# EasyEDA Pro project GIM4310-10_4305-10.epro, board PCB1
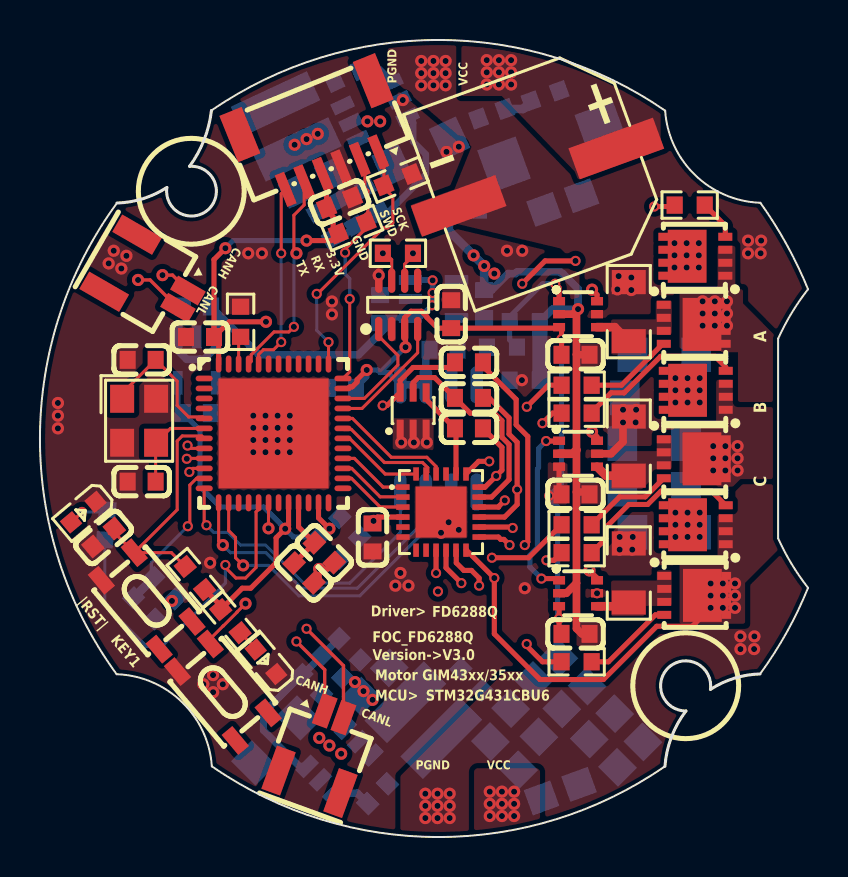
[diagram p1: board, top side]
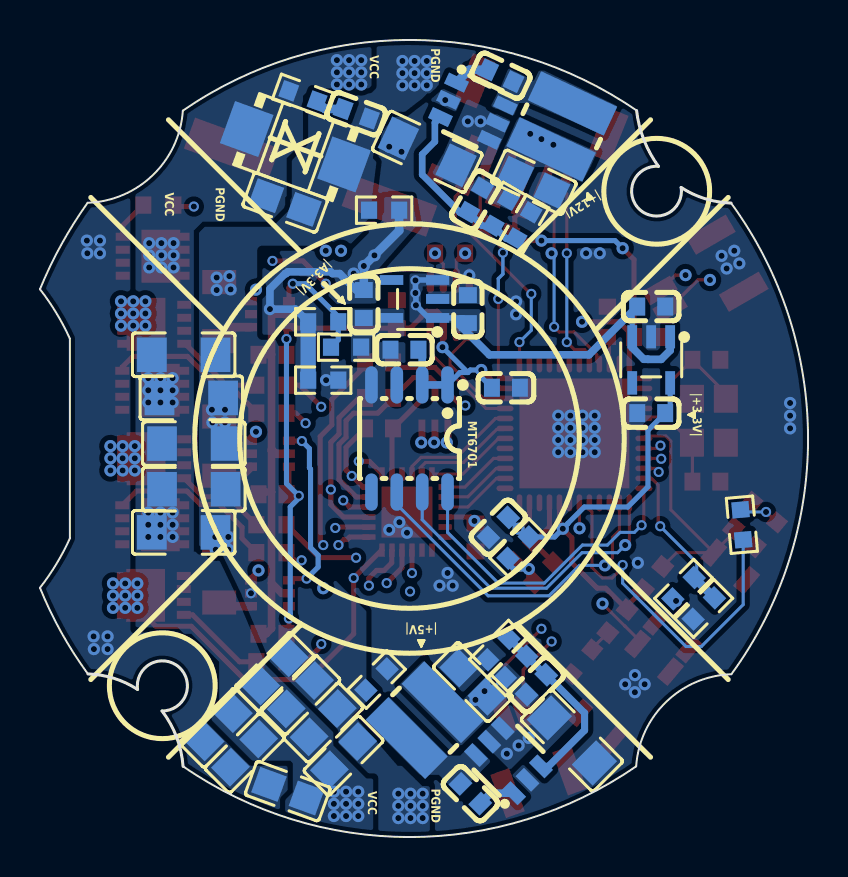
[diagram p2: board, bottom side, seen from below]

Outline 38.45 x 39.9 mm; copper layers: Top Layer, Inner1, Inner2, Bottom Layer. Coordinates in mm from the lower left corner of the outline.
Outline path: 3.84,8.15 arc(0,19.95) 3.85,31.74 arc(5.16,31.96) 6.35,32.51 arc(8.41,31.39) 7.49,33.57 arc(8.21,34.89) 8.58,36.37 arc(19.95,39.9) 31.29,36.36 arc(32.8,33.13) 36.06,31.75 arc(37.38,29.65) 38.45,27.42 arc(37.62,26.23) 36.95,24.95 36.95,14.95 arc(37.62,13.67) 38.45,12.48 arc(37.38,10.24) 36.04,8.16 arc(34.75,7.95) 33.56,7.39 arc(31.51,8.53) 32.33,6.31 arc(31.61,5.01) 31.28,3.54 arc(19.95,0) 8.6,3.54 arc(7.1,6.77) 3.84,8.15
Stack: Top Layer 0.035mm 外层铜厚1oz / Dielectric1 0.2104mm 7628 RC49% 8.6mil / Inner1 0.0152mm 内层铜厚 / Dielectric2 1.065mm 1.1mm H/HOZ Copper / Inner2 0.0152mm 内层铜厚 / Dielectric3 0.2104mm 7628 RC49% 8.6mil / Bottom Layer 0.035mm 外层铜厚1oz

## Design rules (mm)
spacing copperThickness1oz (default): track to track 0.102, other pairs 0.152 to 0.3
spacing copperThickness2oz: track to track 0.203, other pairs 0.152 to 0.3
spacing Plane_innerPlane: track to track 0.102, other pairs 0.152 to 0.3
spacing Copper_copperRegion: track to track 0.102, other pairs 0.152 to 0.3
track width copperThickness1oz (default): min 0.127, default 0.254, max 2.54
track width copperThickness2oz: min 0.203, default 0.254, max 2.54
differential pair differentialPair (default): width min 0.127, default 0.254, max 2.54; gap min 0.152, default 0.152
pour e961 uses Copper_copperRegion
pour e963 uses Copper_copperRegion
pour e965 uses Copper_copperRegion
pour e967 uses Copper_copperRegion
pour e969 uses Copper_copperRegion
pour e970 uses Copper_copperRegion
pour e972 uses Copper_copperRegion
pour e974 uses Copper_copperRegion
pour e976 uses Copper_copperRegion
pour e978 uses Copper_copperRegion
pour e980 uses Copper_copperRegion
pour e982 uses Copper_copperRegion
pour e984 uses Copper_copperRegion
pour e992 uses Copper_copperRegion
pour e995 uses Copper_copperRegion
pour e998 uses Copper_copperRegion
pour e1008 uses Copper_copperRegion
pour e1009 uses Copper_copperRegion
pour e1010 uses Copper_copperRegion
pour e1011 uses Copper_copperRegion
pour e1012 uses Copper_copperRegion
pour e1014 uses Copper_copperRegion
pour e1016 uses Copper_copperRegion
pour e1017 uses Copper_copperRegion
pour e1019 uses Copper_copperRegion
pour e1020 uses Copper_copperRegion
pour e1022 uses Copper_copperRegion
pour e1024 uses Copper_copperRegion
pour e1026 uses Copper_copperRegion
pour e1028 uses Copper_copperRegion
pour e1030 uses Copper_copperRegion
pour e1032 uses Copper_copperRegion
pour e1034 uses Copper_copperRegion
pour e1036 uses Copper_copperRegion
pour e1038 uses Copper_copperRegion
pour e1041 uses Copper_copperRegion
pour e1043 uses Copper_copperRegion
pour e1045 uses Copper_copperRegion
pour e1047 uses Copper_copperRegion
pour e1051 uses Copper_copperRegion
pour e1053 uses Copper_copperRegion
pour e1055 uses Copper_copperRegion
pour e1057 uses Copper_copperRegion
pour e1059 uses Copper_copperRegion
pour e1061 uses Copper_copperRegion
pour e1063 uses Copper_copperRegion

## Placement (name value [footprint] x y rotation side)
C12  47uF/50V  [C1206]  11.82 4.84 45 bottom
C13  100pF  [C0603]  13.6 7.63 315 bottom
C14  22uF/25V  [C0805]  16.77 7.76 225 bottom
C29  10uF  [C0603]  20.58 26.17 270 top
C35  100nF  [C0603]  15.5 15.5 135 bottom
C36  100nF  [C0603]  15.12 22.49 0 bottom
C37  100nF  [C0603]  8.01 25.03 0 top
C41  1uF  [C0603]  14.23 14.23 315 top
C42  10nF  [C0603]  13.22 13.22 315 top
C45  100nF  [C0603]  3.18 15 220 top
C54  10nF/50V  [C0603]  22.62 36.21 200 bottom
C55  22uF/50V  [C1206]  31.25 24.14 0 bottom
C61  22uF/50V  [C1206]  30.87 21.98 0 bottom
C65  100nF  [C0603]  7.85 21.22 0 bottom
C68  100nF  [C0603]  20.2 24.39 0 bottom
C71  20pF  [C0603]  5.09 23.89 0 top
C72  20pF  [C0603]  5.09 17.79 0 top
C100  100nF  [C0603]  16.9 2.17 45 bottom
C101  100nF  [C0603]  15.38 38.11 205 bottom
C102  47uF/50V  [C1206]  19.06 34.3 205 bottom
C103  100pF  [C0603]  16.65 31.89 120 bottom
C104  22uF/25V  [C0805]  13.73 32.78 25 bottom
C105  100nF  [C0603]  7.85 26.55 180 bottom
C106  100nF  [C0603]  22.23 26.68 90 bottom
C107  100nF  [C0603]  17.03 26.43 90 bottom
C108  22uF/50V  [C1206]  30.74 19.7 0 bottom
C109  22uF/50V  [C1206]  30.74 17.41 0 bottom
C112  100nF  [C0603]  15 31.76 202 top
C120  100nF  [C0603]  26.81 24.14 180 top
C121  100nF  [C0603]  26.81 17.16 180 top
C122  100nF  [C0603]  26.81 10.17 180 top
C123  1uF/25V  [C0603]  21.47 20.46 180 top
C124  1uF/25V  [C0603]  21.47 21.98 180 top
C125  1uF/25V  [C0603]  21.47 23.76 180 top
C126  10uF/25V  [C0603]  16.65 15 90 top
C127  22uF/50V  [C1206]  31.25 15.25 0 bottom
C130  330uF  [CAP-SMD_BD10.0-L10.3-W10.3-FD-LS11.0]  24.9 33.03 200 top
C131  10uF/50V  [C0805]  26.17 31.76 20 bottom
C132  10uF/50V  [C0805]  26.68 8.27 315 bottom
C133  10uF/50V  [C0805]  25.41 7.12 315 bottom
C134  10uF/50V  [C0805]  24.27 5.73 315 bottom
C136  10uF/50V  [C0805]  23.25 4.07 315 bottom
C138  10uF/50V  [C0805]  29.47 5.47 135 bottom
C139  10uF/50V  [C0805]  28.2 4.2 135 bottom
C140  10uF/50V  [C0805]  26.04 2.3 200 bottom
D3  BAS16TW  [SOT-363_L2.1-W1.3-P0.65-LS2.3-BL]  18.68 21.35 0 top
D4  SMBJ36CA  [SMB_L4.4-W3.6-LS5.3-BI]  25.66 34.55 200 bottom
L1  3.3uH  [IND-SMD_L3.8-W3.8_GCRH3D16-XX]  12.33 35.57 295 bottom
L2  3.3uH  [IND-SMD_L3.8-W3.8_GCRH3D16-XX]  19.19 5.85 135 bottom
LED6  KT-0603R  [LED0603-RD]  11.31 8.77 130 top
LED7  KT-0603R  [LED0603-RD]  2.17 16.27 220 top
Q7  NCEP3040Q  [POWERVDFN-8_L3.2-W3.1-P0.65-LS3.3-BL-1]  32.75 29.07 90 top
Q8  NCEP3040Q  [POWERVDFN-8_L3.2-W3.1-P0.65-LS3.3-BL-1]  32.78 22.36 90 top
Q9  NCEP3040Q  [POWERVDFN-8_L3.2-W3.1-P0.65-LS3.3-BL-1]  32.78 15.63 90 top
Q10  NCEP3040Q  [POWERVDFN-8_L3.2-W3.1-P0.65-LS3.3-BL-1]  32.78 25.66 270 top
Q11  NCEP3040Q  [POWERVDFN-8_L3.2-W3.1-P0.65-LS3.3-BL-1]  32.78 18.93 270 top
Q12  NCEP3040Q  [POWERVDFN-8_L3.2-W3.1-P0.65-LS3.3-BL-1]  32.8 12.1 270 top
R24  120  [R0603]  17.92 29.22 0 top
R28  0  [R0603]  14.49 14.49 135 bottom
R29  10K  [R0603]  10.04 25.79 90 top
R30  1K  [R0603]  7.76 12.96 130 top
R33  3.3  [R0603]  25.28 37.09 20 bottom
R42  10  [R0603]  32.52 31.63 0 top
R52  10  [R0603]  26.86 21.22 0 top
R53  10  [R0603]  26.86 14.23 0 top
R54  10  [R0603]  26.86 22.62 0 top
R56  10  [R0603]  26.86 8.77 0 top
R60  10  [R0603]  26.86 15.63 0 top
R65  34.8K  [R0603]  6.23 12.46 315 bottom
R67  4.99K  [R0603]  5.22 11.44 135 bottom
R68  3mΩ  [R1206]  29.47 26.3 270 top
R69  3mΩ  [R1206]  29.47 19.57 270 top
R70  3mΩ  [R1206]  29.47 13.22 270 top
R72  110K  [R0603]  14.61 8.52 135 bottom
R73  15K  [R0603]  15.5 9.41 135 bottom
R74  390K  [R0603]  15.38 31.25 300 bottom
R75  20K  [R0603]  14.23 30.62 300 bottom
R79  1K  [R0603]  9.53 10.81 310 top
R80  0  [R0603]  24.27 22.87 0 bottom
R81  0  [R0603]  21.6 7.88 315 bottom
R82  0  [R0603]  21.22 31.38 0 bottom
R85  10K  [R0603]  15.63 30.49 202 top
R86  10K  [R0603]  17.92 32.9 202 top
R101  10K  [R0603]  23.12 24.52 0 bottom
R102  10K  [R0603]  24.27 25.79 0 bottom
R103  1K  [R0603]  3.31 15.63 85 bottom
SW1  K2-1808SN-A3SW-01  [SW-SMD_4P-L4.2-W3.3-P2.15-LS5.1]  5.34 11.82 310 top
SW3  K2-1808SN-A3SW-01  [SW-SMD_4P-L4.2-W3.3-P2.15-LS5.1]  9.15 7.25 310 top
U1  STM32G431CBU6  [VQFN-48_L7.0-W7.0-P0.50-BL-EP5.5]  11.69 20.2 270 top
U2  INA199A1DCKR  [SC-70-6_L2.2-W1.3-P0.65-LS2.1-BR]  26.93 26.17 180 top
U4  INA199A1DCKR  [SC-70-6_L2.2-W1.3-P0.65-LS2.1-BR]  26.93 12.2 180 top
U5  MAX3051EKA+T  [SOT-23-8_L3.0-W1.7-P0.65-LS2.8-TL]  17.93 26.64 90 top
U10  FD6288Q  [QFN-24_L4.0-W4.0-P0.50-BL-EP2.6]  20.08 16.27 270 top
U11  MT6701CT-STD  [SOP-8_L4.9-W3.9-P1.27-LS6.0-BL]  19.95 19.95 0 bottom
U13  SPX3819M5-L-3-3/TR  [SOT-23-5_L3.0-W1.7-P0.95-LS2.8-BL]  7.85 23.89 0 bottom
U20  INA199A1DCKR  [SC-70-6_L2.2-W1.3-P0.65-LS2.1-BR]  26.93 19.19 180 top
U23  ME3121AM6G  [SOT-23-6_L2.9-W1.6-P0.95-LS2.8-BR]  15 3.82 225 bottom
U24  ME3121AM6G  [SOT-23-6_L2.9-W1.6-P0.95-LS2.8-BR]  16.77 36.33 25 bottom
U25  SPX3819M5-L-3-3/TR  [SOT-23-5_L3.0-W1.7-P0.95-LS2.8-BL]  19.69 26.93 90 bottom
U27  ZX-SH1.0-2PWT  [CONN-SMD_2P-P1.00_HX-1.0-2P-WT]  5.6 27.82 240 top
U28  ZX-SH1.0-2PWT  [CONN-SMD_2P-P1.00_HX-1.0-2P-WT]  14.11 4.46 340 top
U29  ZX-SH1.0-6PWT  [CONN-SMD_6P-P1.00_MEGASTAR_ZX-SH1.0-6PWT]  13.98 34.94 202 top
X3  8MHz  [CRYSTAL-SMD_4P-L3.2-W2.5-BL]  4.96 20.84 270 top

## Footprints (pads in the part's own frame, mm; a bottom-side part is the same pattern mirrored in y, then rotated)
C0603
  rect 0.8x0.9 smd: 1(-0.7,0) 2(0.7,0)
C0805
  rect 1.41x1.35 smd: 1(-1,0) 2(1,0)
C1206
  rect 1.485x1.728 smd: 1(-1.593,0) 2(1.593,0)
CAP-SMD_BD10.0-L10.3-W10.3-FD-LS11.0
  rect 4.5x1.65 smd: 1(-4.2,0) 2(4.2,0)
CONN-SMD_2P-P1.00_HX-1.0-2P-WT
  rect 0.8x1.6 smd: 1(-0.5,1.8) 2(0.5,1.8)
  rect 1x2.3 smd: 3(1.65,-1.8) 4(-1.65,-1.8)
CONN-SMD_6P-P1.00_MEGASTAR_ZX-SH1.0-6PWT
  rect 0.5x1.7 smd: 1(-2.5,1.7) 2(-1.5,1.7) 3(-0.5,1.7) 4(0.5,1.7) 5(1.5,1.7) 6(2.5,1.7)
  rect 1.2x2.5 smd: 7(3.6,-1.7) 8(-3.6,-1.7)
CRYSTAL-SMD_4P-L3.2-W2.5-BL
  rect 1.4x1.2 smd: 1(-1.1,-0.85) 2(1.1,-0.85) 3(1.1,0.85) 4(-1.1,0.85)
IND-SMD_L3.8-W3.8_GCRH3D16-XX
  rect 1.6x4.2 smd: 1(-1.27,0) 2(1.27,0)
LED0603-RD
  rect 0.8x0.8 smd: 1(-0.8,0) 2(0.8,0)
POWERVDFN-8_L3.2-W3.1-P0.65-LS3.3-BL-1
  rect 0.4x0.7 smd: 1(-0.975,-1.55) 2(-0.325,-1.55) 3(0.325,-1.55) 4(0.975,-1.55)
  rect 0.4x0.5 smd: 5(0.975,1.55) 6(0.325,1.55) 7(-0.325,1.55) 8(-0.975,1.55)
  rect 2.65x1.94 smd: 8(0,0.36)
QFN-24_L4.0-W4.0-P0.50-BL-EP2.6
  rect 0.28x0.665 smd: 1(-1.25,-1.907) 2(-0.75,-1.907) 3(-0.25,-1.907) 4(0.25,-1.907) 5(0.75,-1.907) 6(1.25,-1.907) 13(1.25,1.907) 14(0.75,1.907) 15(0.25,1.907) 16(-0.25,1.907) 17(-0.75,1.907) 18(-1.25,1.907)
  rect 0.665x0.28 smd: 7(1.907,-1.25) 8(1.907,-0.75) 9(1.907,-0.25) 10(1.907,0.25) 11(1.907,0.75) 12(1.907,1.25) 19(-1.907,1.25) 20(-1.907,0.75) 21(-1.907,0.25) 22(-1.907,-0.25) 23(-1.907,-0.75) 24(-1.907,-1.25)
  rect 2.55x2.55 smd: 25(0,0)
R0603
  rect 0.806x0.864 smd: 1(-0.753,0) 2(0.753,0)
R1206
  rect 1.208x1.701 smd: 1(-1.479,0) 2(1.479,0)
SC-70-6_L2.2-W1.3-P0.65-LS2.1-BR
  rect 0.6x0.42 smd: 1(0.95,-0.65) 2(0.95,0) 3(0.95,0.65) 4(-0.95,0.65) 5(-0.95,0) 6(-0.95,-0.65)
SMB_L4.4-W3.6-LS5.3-BI
  rect 2.047x2.241 smd: 1(-2.591,0) 2(2.591,0)
SOP-8_L4.9-W3.9-P1.27-LS6.0-BL
  oval 0.63x1.865 smd: 1(-1.905,-2.683) 2(-0.635,-2.683) 3(0.635,-2.683) 4(1.905,-2.683) 5(1.905,2.683) 6(0.635,2.683) 7(-0.635,2.683) 8(-1.905,2.683)
SOT-23-5_L3.0-W1.7-P0.95-LS2.8-BL
  rect 0.49x1.157 smd: 1(-0.95,-1.153) 2(0,-1.153) 3(0.95,-1.153)
  rect 0.49x1.175 smd: 4(0.95,1.153) 5(-0.95,1.153)
SOT-23-6_L2.9-W1.6-P0.95-LS2.8-BR
  rect 1.1x0.6 smd: 1(1.35,-0.95) 2(1.35,0) 3(1.35,0.95) 4(-1.35,0.95) 5(-1.35,0) 6(-1.35,-0.95)
SOT-23-8_L3.0-W1.7-P0.65-LS2.8-TL
  oval 1.222x0.364 smd: 1(-1.211,0.975) 2(-1.211,0.325) 3(-1.211,-0.325) 4(-1.211,-0.975) 5(1.211,-0.975) 6(1.211,-0.325) 7(1.211,0.325) 8(1.211,0.975)
SOT-363_L2.1-W1.3-P0.65-LS2.3-BL
  rect 0.35x0.916 smd: 1(-0.65,-0.908) 2(0,-0.908) 3(0.65,-0.908) 4(0.65,0.908) 5(0,0.908) 6(-0.65,0.908)
SW-SMD_4P-L4.2-W3.3-P2.15-LS5.1
  rect 1.3x0.7 smd: 1(-2.25,1.075) 2(2.25,1.075) 3(-2.25,-1.075) 4(2.25,-1.075)
VQFN-48_L7.0-W7.0-P0.50-BL-EP5.5
  oval 0.28x0.85 smd: 1(-2.75,-3.474) 2(-2.25,-3.474) 3(-1.75,-3.474) 4(-1.25,-3.474) 5(-0.75,-3.474) 6(-0.25,-3.474) 7(0.25,-3.474) 8(0.75,-3.474) 9(1.25,-3.474) 10(1.75,-3.474) 11(2.25,-3.474) 12(2.75,-3.474) 25(2.75,3.474) 26(2.25,3.474) 27(1.75,3.474) 28(1.25,3.474) 29(0.75,3.474) 30(0.25,3.474) 31(-0.25,3.474) 32(-0.75,3.474) 33(-1.25,3.474) 34(-1.75,3.474) 35(-2.25,3.474) 36(-2.75,3.474)
  oval 0.85x0.28 smd: 13(3.474,-2.75) 14(3.474,-2.25) 15(3.474,-1.75) 16(3.474,-1.25) 17(3.474,-0.75) 18(3.474,-0.25) 19(3.474,0.25) 20(3.474,0.75) 21(3.474,1.25) 22(3.474,1.75) 23(3.474,2.25) 24(3.474,2.75) 37(-3.474,2.75) 38(-3.474,2.25) 39(-3.474,1.75) 40(-3.474,1.25) 41(-3.474,0.75) 42(-3.474,0.25) 43(-3.474,-0.25) 44(-3.474,-0.75) 45(-3.474,-1.25) 46(-3.474,-1.75) 47(-3.474,-2.25) 48(-3.474,-2.75)
  rect 5.5x5.5 smd: 49(0,0)

## Nets
As in the schematic.

Pads without a net: SW1 2 4; SW3 2 4; U1 1 2 3 4 15 16 19 22 24 25 29 38 39 40 41 42 43 47; U5 5; U10 5 7 8 21; U11 3 5; U13 4; U25 4; U27 3 4; U28 3 4; U29 7 8

## Via types
v1: diameter 0.61, hole 0.305, Top Layer to Bottom Layer, 196 vias
v2: diameter 0.508, hole 0.305, Top Layer to Bottom Layer, 47 vias

## Routing (per net, layer and track width the routed paths; a pad name or vN(x,y) marks a point on that pad's centre or on a via; arc(x,y) is an arc through that point)
+3.3V: length 96.4
  Top Layer w0.254: C120.2 v2(26.11,24.93) 26.11,25.4 U2.3 25.93,25.47 C29.2 19.91,25.47 19.37,26.01 19.37,26.05 19.1,26.32 18.57,26.32 18.26,26 U5.3 18.3,25.39 v1(18.3,24.52) ; U20.3 25.98,17.28 C121.2 26.03,17.08 v2(25.49,17.08) ; U4.3 v2(25.98,10.94) 25.98,10.29 C122.2 ; U1.48 8.94,24.8 C37.2 ; v1(9.28,29.47) 8.71,28.9 C37.2 ; v1(14.49,15.43) 13.94,15.98 U1.23 ; U1.35 15.43,22.45 15.51,22.53 15.63,22.53 15.87,22.78 15.87,22.89 v1(16.36,23.38) ; C37.2 9.47,25.79 v1(11.31,25.79) ; R30.1 9.05,11.58 9.05,11.38 10.12,12.46 10.55,12.46 11.82,13.73 11.82,14.98 v1(12.27,15.43) 12.44,15.6 U1.20 ; v1(13.34,29.86) 14.58,29.86 14.93,30.21 14.81,30.21 14.68,30.34 14.68,31.04 14.35,31.37 C112.2 14.35,32.85 14.15,33.04 U29.4
  Inner2 w0.254: v1(16.36,23.38) 16.36,23.34 16.27,23.25 ; 16.27,23.25 12.85,23.25 11.54,24.55 11.54,25.56 v1(11.31,25.79) ; 16.27,23.25 15.5,22.49 15.5,16.45 v1(14.49,15.43)
  Bottom Layer w0.254: C36.2 16.36,23.02 v1(16.36,23.38) 16.9,23.38 17.03,23.25 ; 17.03,23.25 v1(18.3,24.52) ; 17.03,23.25 17.42,23.25 U11.1 ; C35.2 15.01,15.96 v1(14.49,15.43) 14.07,15.02 R28.2 12.69,15.02 v1(12.27,15.43) 12.02,15.68 12.02,15.7 11.2,16.52 9.03,16.52 8.01,17.54 8.01,20.36 C65.1 6.9,21.47 U13.5 ; v2(25.49,17.08) 26.11,17.7 v2(26.11,24.93) ; 26.04,11.06 25.92,11.19 25.92,16.53 25.49,16.95 25.49,17.08 ; v1(9.28,29.47) 9.66,29.86 v1(13.34,29.86)
  Bottom Layer w0.381: U11.1 U11.2 19.31,24.21 C68.1
+5V: length 20.8
  Bottom Layer w0.254: U13.3 8.8,26.3 C105.1
  Bottom Layer w0.28: U25.3 19.63,27.88 v2(19.65,27.87) v2(19.65,27.23) 19.63,27.21 v2(19.63,26.62) 18.99,25.98 U25.1 17.29,25.98 C107.1
  Bottom Layer w0.381: U13.1 6.9,24.36 7.35,23.91 8.01,23.91 8.01,23.92 8.22,23.92 8.8,24.5 U13.3 ; 17.54,25.73 15.95,24.14 10.96,24.14 8.8,26.3
  vias: v1(15.77,7.76) v1(16.19,7.3) v1(16.65,6.87)
+12V: length 1.6
  Top Layer w0.254: v1(16.7,15.82) 16.89,16.02 U10.4
  vias: v1(12.75,34.65) v1(13.34,34.94) v1(13.9,35.2) v1(18.08,19.75) v1(18.72,19.75) v1(19.36,19.75)
AGND: length 37.4
  Top Layer w0.381: 26.85,24.16 26.87,24.14 C120.1 ; 26.85,24.16 26.85,17.27 ; 26.85,24.16 26.85,26.35 ; 26.85,12.71 26.85,10.44 27.12,10.17 C122.1 ; 26.85,12.71 26.34,12.2 U4.2 ; 26.85,12.71 26.85,17.27 ; 26.85,26.35 26.68,26.17 U2.2 ; 26.85,26.35 v1(26.93,26.43) ; 26.85,17.27 27.39,17.27 C121.1
  Top Layer w0.432: U20.2 26.67,19.19 26.85,19.37
  Bottom Layer w0.381: R102.2 25.66,26.43 v1(26.93,26.43) 26.93,27.44 26.17,28.2 26.13,28.2 26.04,28.29 23.89,28.29 23.8,28.2 23.44,28.2 22.62,27.38 C106.2
  Bottom Layer w0.432: R82.1 20.47,30.35 v1(21.7,29.12) v1(22.23,28.59) C106.2
  Bottom Layer w0.762: R80.2 R102.2
  vias: v1(22.74,28.2)
GND:
  vias: v1(0.9,21.73) v1(0.9,21.09) v1(0.9,20.46) v1(3.44,28.71) v1(3.69,29.35) v1(4.07,28.46) v1(4.33,29.09) v1(8.18,7.65) v1(8.52,13.73) v1(8.66,8.11) v1(8.67,7.25) v1(9.15,7.65) v1(10.42,29.22) v1(10.68,21.09) v1(10.68,20.48) v1(10.68,19.87) v1(10.68,19.26) v1(11.11,29.22) v1(11.29,21.09) v1(11.29,20.48) v1(11.29,19.87) v1(11.29,19.26) v1(11.9,21.09) v1(11.9,20.48) v1(11.9,19.87) v1(11.9,19.26) v1(12.51,21.09) v1(12.51,20.48) v1(12.51,19.87) v1(12.51,19.26) v1(14.61,26.81) v1(14.61,26.16) v1(16.96,28.11) v1(17.79,12.58) v1(18.04,13.22) v1(18.16,36.89) v1(18.44,12.58) v1(20.08,15.23) v1(20.35,34.3) v1(20.46,15.76) v1(20.96,34.55) v1(20.96,15.38) v1(23.38,29.35) v1(24.14,29.35) v1(24.12,22.87) v1(24.27,12.46)
PGND: length 2.5
  Top Layer w0.381: v1(29.18,20.75) 29.18,19.79 28.58,19.19 U20.5
  vias: v1(19.09,38.85) v1(19.09,38.24) v1(19.09,37.63) v1(19.29,2.17) v1(19.29,1.56) v1(19.29,0.95) v1(19.69,38.85) v1(19.69,38.24) v1(19.69,37.63) v1(19.9,2.17) v1(19.9,1.56) v1(19.9,0.95) v1(20.3,38.85) v1(20.3,38.24) v1(20.3,37.63) v1(20.51,2.17) v1(20.51,1.56) v1(20.51,0.95) v1(28.97,28.08) v1(28.9,27.41) v1(29.02,15.02) v1(29.02,14.39) v1(29.18,21.39) v1(29.6,28.01) v1(29.6,27.38) v1(29.67,15.02) v1(29.65,14.39) v1(29.84,21.39) v1(29.82,20.75) v1(35.06,10.04) v1(35.06,9.41) v1(35.44,29.86) v1(35.44,29.22) v1(35.76,10.04) v1(35.75,9.41) v1(36.1,29.86) v1(36.07,29.22) v2(27.88,12.2)
VCC: length 10.5
  Inner1 w0.254: v1(6.61,11.82) 6.61,11.32 12.96,4.96 v1(13.98,4.96)
  vias: v1(14.49,4.58) v1(15.08,4.17) v1(16.39,35.82) v1(17.03,35.82) v1(22.36,38.89) v1(22.36,38.28) v1(22.36,37.67) v1(22.51,2.27) v1(22.51,1.66) v1(22.51,1.05) v1(22.97,38.89) v1(22.97,38.28) v1(22.97,37.67) v1(23.12,2.27) v1(23.12,1.66) v1(23.12,1.05) v1(23.58,38.89) v1(23.58,38.28) v1(23.58,37.67) v1(23.73,2.27) v1(23.73,1.66) v1(23.73,1.05) v1(31.76,29.73) v1(31.76,29.12) v1(31.76,28.51) v1(31.81,22.97) v1(31.81,22.36) v1(31.81,21.75) v1(31.81,16.24) v1(31.81,15.63) v1(31.81,15.02) v1(32.37,29.73) v1(32.37,29.12) v1(32.37,28.51) v1(32.42,22.97) v1(32.42,22.36) v1(32.42,21.75) v1(32.42,16.24) v1(32.42,15.63) v1(32.42,15.02) v1(32.98,29.73) v1(32.98,29.12) v1(32.98,28.51) v1(33.03,22.97) v1(33.03,22.36) v1(33.03,21.75) v1(33.03,16.24) v1(33.03,15.63) v1(33.03,15.02)
VDDA: length 3.8
  Top Layer w0.254: C42.1 C41.1 12.94,15.52 U1.21
ADC_IN1: length 39.7
  Top Layer w0.152: v2(7.39,19.59) 7.53,19.45 U1.8
  Top Layer w0.254: U2.6 27.88,27.15 v1(27.63,27.4)
  Inner2 w0.158: v2(7.39,19.59) 8.65,18.34 8.65,17.16 14.09,11.71 24.66,11.71 27.06,14.11 27.06,20.46 27.09,20.49 27.09,20.51 27.41,20.83 27.43,20.83 27.44,20.84 27.44,24.9 27.63,25.09 v1(27.63,27.4)
ADC_IN2: length 32.7
  Top Layer w0.152: U1.9 7.37,18.95 v2(7.35,18.93)
  Top Layer w0.254: U20.6 27.88,20.04 v1(27.63,20.29)
  Inner2 w0.158: v1(27.63,20.29) 27.63,14.3 24.77,11.44 13.85,11.44 11.36,13.93 11.36,13.93 9.03,16.27 9.03,16.27 8.26,17.03 8.26,18.18 7.68,18.77 7.52,18.77 v2(7.35,18.93)
ADC_IN3: length 26.3
  Top Layer w0.152: U1.10 7.65,18.45 v2(7.48,18.28)
  Top Layer w0.254: v1(27.51,13.35) 27.88,12.97 U4.6
  Inner2 w0.158: v2(7.48,18.28) 7.48,16.8 8.14,16.14 8.77,16.14 10.77,14.14 10.77,14.14 11.09,13.82 11.09,13.82 13.85,11.06 24.9,11.06 27.19,13.35 v1(27.51,13.35)
ADC_IN4: length 7.8
  Top Layer w0.152: U1.11 7.84,17.95 7.5,17.62 7.5,15.66 v2(7.4,15.56)
  Bottom Layer w0.152: v2(7.4,15.56) 5.57,13.73 5.57,12.86
  Bottom Layer w0.432: 4.56,11.85 5.57,12.86
BOOT0: length 1.3
  Top Layer w0.152: 10.04,24.91 9.94,24.81 U1.46
CANH: length 51.7
  Top Layer w0.152: 17.29,29.22 17.61,28.91 U5.7
  Top Layer w0.168: v2(12.84,9.79) 14.25,8.37 U28.1 ; v1(6.13,28.13) 6.64,28.13 U27.1
  Inner1 w0.168: v2(12.84,9.79) 10.55,9.79 9.04,11.3 arc(8.89,11.66) 9.04,12.02 9.05,12.03 arc(9.05,12.75) 8.33,12.75 8.32,12.74 arc(7.6,12.74) 7.6,13.46 7.61,13.47 arc(7.61,14.18) 6.89,14.18 6.88,14.18 arc(6.16,14.18) 6.16,14.89 6.17,14.9 arc(6.17,15.62) 5.45,15.62 5.45,15.61 arc(4.73,15.61) 4.73,16.33 4.74,16.34 arc(4.74,17.06) 4.02,17.06 4.01,17.05 arc(3.65,16.9) 3.29,17.05 2.55,17.79 2.55,23.51 6.13,27.09 v1(6.13,28.13) 6.69,27.57 7.7,27.57 arc(7.97,27.68) 8.08,27.94 arc(8.19,28.21) 8.45,28.32 9.23,28.32 arc(9.49,28.21) 9.6,27.94 arc(9.71,27.68) 9.97,27.57 10.25,27.57 arc(10.51,27.68) 10.62,27.94 arc(10.73,28.21) 11,28.32 11.77,28.32 arc(12.04,28.21) 12.15,27.94 arc(12.26,27.68) 12.52,27.57 13.29,27.57 arc(13.53,27.67) 13.63,27.9 arc(13.73,28.14) 13.96,28.24 14.31,28.24 arc(14.55,28.14) 14.64,27.9 arc(14.74,27.67) 14.98,27.57 15.51,27.57 v1(17.16,29.22)
CANL: length 52.1
  Top Layer w0.152: 18.8,29.22 18.26,28.68 U5.6
  Top Layer w0.168: v2(13.34,10.42) 15.19,8.58 U28.2 ; v1(4.91,27.89) 5.51,27.89 U27.2
  Inner1 w0.168: v1(18.67,29.22) 18.04,29.86 14.24,29.86 12.97,28.59 6.61,28.59 6.36,28.84 5.86,28.84 v1(4.91,27.89) 4.58,27.56 4.58,26.81 1.89,24.11 1.89,17.94 10.59,9.24 13.06,9.24 13.7,9.88 13.7,10.26 13.53,10.42 v2(13.34,10.42)
FDCAN1_RX: length 6.1
  Top Layer w0.152: U5.4 18.91,24.24 16.12,21.45 U1.33
FDCAN1_TX: length 5.6
  Top Layer w0.152: U1.34 16.24,21.95 17.92,23.63 17.92,24.11 16.96,25.07 U5.1
GH_A: length 19.8
  Top Layer w0.254: R42.1 31.7,31.56 v2(30.74,31.56) ; U10.19 21.96,18.81 v2(22.49,18.81)
  Inner1 w0.254: 30.74,31.51 28.71,31.51 24.9,27.7 24.9,21.22 v2(22.49,18.81)
GH_B: length 7.2
  Top Layer w0.254: v2(25.15,20.72) 25.66,21.22 R52.1 ; U10.16 22.96,16.52 22.96,16.55 v2(23.27,16.85)
  Inner1 w0.254: v2(23.27,16.85) 23.27,17.68 23.89,18.3 23.89,19.45 v2(25.15,20.72)
GH_C: length 4.8
  Top Layer w0.254: U10.13 22.95,15.02 23.06,14.9 23.22,14.9 v2(23.5,14.62) ; v2(25.35,13.85) 25.73,13.85 R53.1
  Inner1 w0.254: v2(25.35,13.85) 24.27,13.85 v2(23.5,14.62)
GL_A: length 16.9
  Top Layer w0.254: v2(21.98,12.58) 21.98,12.96 21.6,13.35 21.22,13.35 20.84,13.73 20.84,14.35 U10.11 ; R54.1 25.45,22.62 v2(24.37,21.54)
  Inner1 w0.254: v2(24.37,21.54) 21.85,19.02 21.85,18.04 22.74,17.16 22.74,17.08 22.73,17.07 22.73,16.63 22.74,16.62 22.74,15.12 22.75,15.12 22.75,14.62 23.5,13.86 23.5,12.84 23,12.33 22.23,12.33 v2(21.98,12.58)
GL_B: length 8.2
  Top Layer w0.254: v2(21.09,12.71) 20.33,13.48 U10.10 ; R60.1 24.46,13.98 v2(22.62,13.98)
  Inner1 w0.254: v2(21.09,12.71) 22.36,13.98 v2(22.62,13.98)
GL_C: length 9.3
  Top Layer w0.254: v2(24.36,9.66) 24.36,9.56 25.16,8.77 R56.1 ; U10.9 v2(19.83,13.21)
  Inner1 w0.254: v2(19.83,13.21) 23.38,9.66 v2(24.36,9.66)
KEY1: length 8.3
  Top Layer w0.152: SW3.1 8.53,9.93 9.17,10.57 9.18,10.57 9.87,11.26 9.87,11.27 v1(10.29,11.69) ; U1.18 11.44,16.72 v1(11.44,15.45)
  Inner1 w0.152: v1(11.44,15.45) 11.44,12.84 v1(10.29,11.69)
LED1: length 17.8
  Top Layer w0.152: v2(9.28,13.62) 9.28,13.49 9.81,12.96 10.29,12.96 10.82,13.49 10.82,16.28 10.94,16.41 U1.17
  Bottom Layer w0.152: R103.1 3.25,11.63 5.34,9.54 6.11,9.54 9.28,12.71 v2(9.28,13.62)
NRST: length 12.5
  Top Layer w0.152: SW1.1 6.87,16.38 6.87,19.82 7.12,20.08 8.1,20.08 U1.7 ; SW1.1 3.76,15.19 3.47,15.19 ; SW1.1 6.58,14.24 R30.2
OSC_IN: length 7
  Top Layer w0.152: X3.1 4.11,22.21 C71.2 6.87,22.81 6.87,21.6 7.44,21.03 8.14,21.03 U1.5
OSC_OUT: length 4.7
  Top Layer w0.152: U1.6 6.53,20.45 X3.3 5.79,19.72 C72.2
PWMAH: length 6
  Top Layer w0.158: U1.32 15.64,20.95 17.59,19.01 19.37,19.01 19.83,18.55 U10.22
PWMAL: length 3.6
  Top Layer w0.158: U1.28 15.74,18.95 17.17,17.52 U10.1
PWMBH: length 5.4
  Top Layer w0.158: U10.23 19.41,18.26 19.41,18.48 19.15,18.75 17.24,18.75 15.59,20.4 15.22,20.4 U1.31
PWMBL: length 3.6
  Top Layer w0.158: U1.27 15.6,18.45 17.03,17.03 18.16,17.03 U10.2
PWMCH: length 4.4
  Top Layer w0.158: U1.30 15.5,19.95 17.28,18.17 18.82,18.17 U10.24
PWMCL: length 3.6
  Top Layer w0.158: U10.3 18.16,16.52 17.03,16.52 15.59,17.95 U1.26
REF: length 23.1
  Top Layer w0.254: U20.1 25.97,19.82 v2(25.34,19.82) ; v2(25.1,12.94) 25.9,12.94 U4.1 ; U2.1 25.98,27.5 v2(25.79,27.7)
  Inner1 w0.254: v2(25.79,27.7) 25.41,27.32 25.41,21.35 25.92,20.84 25.92,20.4 v2(25.34,19.82)
  Bottom Layer w0.254: v2(25.1,12.94) 24.52,13.52 24.52,14.11 24.9,14.49 24.9,18.43 24.96,18.48 24.96,19.45 v2(25.34,19.82) ; R101.2 23.51,24.88 R102.1 23.51,26.05 25.16,27.7 v2(25.79,27.7)
SH_A: length 24.9
  Top Layer w0.254: v2(24.14,27.7) 25.28,28.84 v2(26.81,28.84) ; U10.18 22.28,17.52 v2(22.84,18.08) 23.12,18.36 23.12,19.51 C123.1
  Inner1 w0.254: v2(26.81,28.84) 30.24,28.84 30.49,28.59 30.49,27.95 31.12,27.32 32.67,27.32 v1(33.17,26.82)
  Inner2 w0.254: v2(24.14,27.7) 23.02,26.58 23.02,18.26 v2(22.84,18.08)
  vias: v1(33.17,26.21) v1(33.17,25.6) v1(33.78,26.82) v1(33.78,26.21) v1(33.78,25.6) v1(34.39,26.82) v1(34.39,26.21) v1(34.39,25.6)
SH_B: length 19.6
  Top Layer w0.254: U10.15 23.26,16.02 23.89,16.65 v2(23.89,17.39) 23.89,19.76 23.48,20.17 23.48,20.99 22.48,21.98 C124.1
  Inner1 w0.254: v1(33.7,18.96) 32.93,18.96 31,17.03 28.97,17.03 28.08,17.92 24.41,17.92 v2(23.89,17.39)
  vias: v1(33.7,19.57) v1(33.7,18.35) v1(34.31,19.57) v1(34.31,18.96) v1(34.31,18.35) v1(34.92,19.57) v1(34.92,18.96) v1(34.92,18.35)
SH_C: length 32.3
  Top Layer w0.254: U10.12 21.35,14.36 v2(22.74,12.96) 22.74,10.17 25.03,7.88 28.2,7.88 30.87,10.55 32.65,10.55 v1(33.57,11.47) ; v2(24.27,14.62) 24.42,14.77 24.42,20.05 23.84,20.63 23.84,21.9 22.17,23.57 C125.1 ; v1(33.57,11.47) v1(34.18,12.08) ; v1(33.57,11.47) 32.56,11.47
  Inner2 w0.254: v2(24.27,14.62) 24.27,14.49 v2(22.74,12.96)
  vias: v1(33.57,12.69) v1(33.57,12.08) v1(34.18,12.69) v1(34.18,11.47) v1(34.79,12.69) v1(34.79,12.08) v1(34.79,11.47)
SL_A: length 1.9
  Top Layer w0.432: R68.2 28.77,25.52 U2.4
SL_B: length 1.8
  Top Layer w0.432: R69.2 28.33,18.09 U20.4
SL_C: length 1.7
  Top Layer w0.432: U4.4 29.29,11.55 R70.2
SPI1_CS: length 15.9
  Top Layer w0.152: v2(8.33,15.61) 8.22,15.72 U1.12
  Bottom Layer w0.152: U11.8 18.04,15.25 15.5,12.71 13.2,12.71 11.29,14.62 10.04,14.62 9.41,15.25 8.69,15.25 v2(8.33,15.61)
SPI1_MISO: length 17
  Top Layer w0.152: U1.14 9.44,15.34 9.79,15 9.79,13.98 v1(10.17,13.6)
  Bottom Layer w0.152: U11.6 20.58,16.65 16.01,12.08 12.96,12.08 11.44,13.6 v1(10.17,13.6)
SPI1_SCK: length 16.1
  Top Layer w0.152: U1.13 8.94,14.83 v1(9.15,14.62)
  Bottom Layer w0.152: v1(9.15,14.62) 9.54,14.23 11.31,14.23 13.09,12.46 15.88,12.46 19.31,15.89 U11.7
SWCLK: length 12.9
  Top Layer w0.152: U1.37 v2(14.44,24.78) ; 17.09,32.62 17.66,32.05 17.66,30.74 17.41,30.49 17.19,30.49 13.89,27.19 v2(13.85,27.19) ; R86.2 17.22,34.01 U29.1
  Bottom Layer w0.152: v2(14.44,24.78) 13.85,25.37 v2(13.85,27.19)
SWDIO: length 11.9
  Top Layer w0.152: U1.36 15.5,23.29 v2(15.5,26.93) ; U29.2 16.27,33.66 16.27,32.49 16.41,32.35 16.41,31.27 16.27,31.13 16.27,30.84 R85.1
  Top Layer w0.168: R85.1 16.33,30.49 15.27,29.43 v2(15.27,29.25)
  Bottom Layer w0.168: v2(15.27,29.25) 15.27,28.18 15.5,27.95 v2(15.5,26.93)
U1_RX: length 10.8
  Top Layer w0.152: U1.45 10.58,23.81 10.58,24.14 11.71,25.28 12.46,25.28 v2(12.71,25.54) ; 13.23,32.8 13.23,31.64 12.71,31.13 12.71,29.35 v1(12.84,29.22)
  Bottom Layer w0.152: v1(12.84,29.22) 12.71,29.09 v2(12.71,25.54)
U1_TX: length 9.6
  Top Layer w0.152: 12.3,32.42 12.07,32.2 v2(12.07,29.22) ; v2(12.07,24.78) 11.69,24.39 11.19,24.39 10.94,24.15 U1.44
  Bottom Layer w0.152: v2(12.07,24.78) v2(12.07,29.22)
VB_A: length 4.7
  Top Layer w0.254: U10.20 20.83,20.4 C123.2 19.33,21.9 D3.4
VB_B: length 10.9
  Top Layer w0.254: D3.5 18.68,22.74 18.93,23 19.76,23 C124.2 21.53,21.22 22.74,21.22 23.12,20.84 23.12,20.01 23.48,19.65 23.48,17.89 22.6,17.02 U10.17
VB_C: length 22.1
  Top Layer w0.254: U10.14 23.62,15.52 v2(23.66,15.47) ; v2(17.15,21.6) 17.37,21.6 D3.6 18.03,22.86 18.68,23.51 20.52,23.51 C125.2
  Inner1 w0.254: v2(17.15,21.6) 17.41,21.35 17.41,14.81 v2(19.92,12.29)
  Inner2 w0.254: v2(19.92,12.29) 22.78,15.15 23.34,15.15 v2(23.66,15.47)
$1N4632: length 9.3
  Bottom Layer w0.33: R75.2 15.12,29.96 R74.2 16.32,30.6 C103.1 17.44,31.28 19.31,33.16 19.31,34.17 18.68,34.81 18.68,35.76 U24.3
$1N4685: length 9.1
  Bottom Layer w0.355: U23.3 12.99,3.54 11.19,5.34 11.19,6.21 C13.1 13.16,8.13 R72.2 R73.2
$1N4686: length 1.2
  Top Layer w0.152: 10.02,10.23 10.8,9.45 LED6.2
$1N4733: length 1.9
  Bottom Layer w0.381: 16.41,1.67 15.89,2.19 U23.1
$1N4735: length 1.9
  Bottom Layer w0.432: C101.1 16.95,38.41 U24.1
$1N4739: length 1.5
  Bottom Layer w0.432: C54.1 24.18,36.44 R33.1
$1N4807: length 4.6
  Top Layer w0.254: R56.2 28.46,8.77 30.81,11.12 Q12.4
$1N4872: length 2
  Top Layer w0.254: R42.2 34.3,30.6 Q7.4
$1N4906: length 4.5
  Top Layer w0.254: R54.2 29.1,22.62 30.43,23.94 30.44,23.94 30.6,24.1 30.6,24.11 31.18,24.69 Q10.4
$1N4907: length 4.6
  Top Layer w0.254: Q11.4 30.3,17.03 29.01,17.03 R60.2
$1N4938: length 8.6
  Top Layer w0.254: Q9.4 33.61,17.32 31.09,17.32 30.42,16.65 29.47,16.65 28.33,15.5 28.33,14.95 R53.2
$1N4945: length 8.3
  Top Layer w0.254: R52.2 27.62,21.27 28.58,22.24 29.24,22.24 31.07,24.06 33.79,24.06 34.33,23.53 Q8.4
$1N19519: length 3.1
  Top Layer w0.254: C41.2 14.41,13.42 v1(13.98,13.42) 13.98,12.99 C42.2
  Bottom Layer w0.254: v1(13.98,13.42) 14.74,13.42 15.02,13.7 R28.1
$1N21693: length 2.1
  Top Layer w0.152: v2(2.1,16.27) 1.58,15.75 LED7.2
  Bottom Layer w0.152: R103.2 3.27,16.27 v2(2.1,16.27)

## Copper pours and planes (outline as drawn; the poured copper is in the pictures)
+3.3V on Top Layer: 25.42,18.79 26.43,18.79 26.43,16.65 25.42,16.65
+3.3V on Inner2: 10.7,26.22 12.07,26.22 12.07,24.52 12.46,24.14 16.18,24.14 16.96,24.91 18.22,24.91 18.3,24.99 18.85,24.99 18.93,24.9 18.93,24.14 18.81,24.01 17.67,24.01 15.88,22.23 15.88,16.59 14.73,15.23 14.28,15.23 14.28,16.69 14.49,16.9 14.49,22.62 14.61,22.74 14.61,23.2 10.88,23.2 10.68,23 10.68,26.19
+5V on Bottom Layer: 17.78,28.21 17.78,27.57 19.29,27.57 19.29,26.43 16.39,26.43 16.39,25.23 17.66,25.23 17.66,25.75 19.95,25.75 19.95,28.2 19.94,28.21
+5V on Bottom Layer: 15.12,8.76 15.12,8.77 15.78,8.11 16.04,8.11 17.28,6.87 19.19,8.77 19.19,8.9 20.46,7.63 17.41,4.58 17.34,4.58 14.85,7.07 14.85,7.12 14.23,6.49 13.98,6.49 13.47,7 13.47,7.12 13.49,7.12
+5V on Inner1: 19.37,26.01 20.09,26.01 20.09,28.35 20.2,28.46 19.22,28.46 19.22,27.19 16.52,27.19 14.87,25.54 14.87,7.31 16.01,6.17 16.98,6.17 17.56,6.75 15.78,8.53 15.63,25.32 16.27,26.05 19.33,26.05
+12V on Top Layer: 17.66,20.97 19.7,20.97 19.7,19.31 17.66,19.31
+12V on Bottom Layer: 16.65,32.9 17.02,32.41 15.89,31.77 14.86,31.35 14.71,31.5 14.59,31.72 14.47,31.9 14.4,32.1 13.66,33.54 13.11,33.54 11.31,32.78 10.87,33.6 10.55,34.3 14.5,36.07 15.93,32.89 16.26,33 16.51,33.1
+12V on Inner1: 12,34.85 12.58,34.17 14.82,29.96 18.67,29.96 20.19,28.45 20.19,26.21 19.87,25.89 16.37,25.89 15.72,25.25 15.72,15.12 17.41,15.12 17.41,19.33 19.78,19.33 19.78,21.04 18.04,22.78 18.04,24.9 18.17,25.03 21.2,25.03 21.2,28.83 19.06,30.87 15.61,30.85 14.68,32.45 14.35,34.06 14.61,34.43 14.11,35.95
+AVDD_3.3V on Bottom Layer: 20.23,26.45 22.88,26.45 22.88,23.76 21.85,23.76 21.85,25.03 20.2,25.03 20.2,26.43
AGND on Top Layer: 26.85,24.7 28.11,24.7 28.11,23.51 26.85,23.51
AGND on Top Layer: 26.85,10.82 28.11,10.82 28.11,9.55 26.81,9.55 26.85,9.6
AGND on Top Layer: 26.85,17.79 28.08,17.79 28.08,16.65 26.85,16.65
AGND on Bottom Layer: 19.83,32.04 19.57,30.62 21.6,28.33 21.6,26.68 24.27,26.68 24.27,25.14 27.31,25.14 27.31,29.35 22.87,29.35 20.88,31.34 20.88,32.1
AGND on Bottom Layer: 19.83,32.04 19.83,30.62 21.83,28.62 21.83,26.68 23.25,26.68 24.52,27.95 24.65,27.95 24.65,21.22 25.71,20.16 25.71,19.82 26.04,19.82 26.11,19.76 26.11,25.03 27.63,25.03 27.63,29.47 23,29.47 21.22,31.25 21.22,32.04
AGND on Inner2: 19.82,31.6 25.66,31.6 25.66,25.13 21.07,25.13 19.87,25.09
GND on Top Layer: -9.01,45.86 40.78,45.86 40.78,-4.56 -9.01,-4.56
GND on Bottom Layer: -0.63,41.29 25.54,41.29 25.54,-0.5 -0.63,-0.5
GND on Inner1: -1.26,40.4 40.9,40.4 40.9,-1.64 -1.26,-1.64
GND on Inner2: 8.64,22.95 14.46,22.95 14.46,16 13.94,16 13.94,15.02 14.75,15.02 16,16.27 16.27,16.27 17.79,17.79 21.73,17.79 21.73,14.49 19.18,11.95 14.23,11.95 8.65,17.54 8.65,17.62 8.64,17.62
PGND on Top Layer: 18.68,2.86 18.69,2.94 18.74,3.01 18.8,3.05 18.88,3.07 20.89,3.07 20.97,3.05 21.03,3.01 21.08,2.94 21.09,2.86 21.09,0.47 21.08,0.4 21.03,0.33 20.97,0.29 20.89,0.27 18.88,0.27 18.8,0.29 18.74,0.33 18.69,0.4 18.68,0.47
PGND on Top Layer: 17.41,40.4 40.65,40.4 41.03,40.02 41.03,-0.37 40.9,-0.24 18.04,-0.24 18.04,3.06 23.28,8.29 25.02,8.29 25.43,7.88 27.26,7.88 27.26,28.25 26.04,29.47 20.84,30.7 19.06,30.11 18.55,31.63 20.74,32.42 21.6,34.55 17.41,38.15
PGND on Bottom Layer: 21.61,35.18 21.5,35.46 21.31,35.73 20.78,36.31 20.17,36.3 19.31,36.97 19.06,37.22 18.93,37.22 15.86,39.89 35.82,39.89 39,36.71 39,0.26 38.36,-0.37 19.06,-0.37 18.93,-0.24 18.93,2.55 19.31,2.55 20.33,3.57 20.54,3.57 22.74,6.11 22.85,6.03 21.56,7.32 22.11,7.87 22.11,11.31 24.14,13.35 26.01,13.65 25.92,13.74 25.92,25.52 27.46,27.06 28.2,27.06 27.82,27.82 27.25,28.01 27.19,27.95 26.81,28.84 26.55,28.97 23.25,28.97 23,28.71 22.24,29.47 22.24,30.7 22.01,30.93 21.59,30.93 21.59,31.76 21.85,31.76 21.6,33.79 21.79,33.98
PGND on Inner2: -1.26,41.03 41.67,41.03 41.67,-2.02 -1.26,-2.02
VCC on Top Layer: 21.85,39.57 21.87,39.64 21.91,39.71 21.98,39.75 22.06,39.77 24.06,39.77 24.14,39.75 24.21,39.71 24.25,39.64 24.27,39.57 24.27,37.3 24.25,37.23 24.21,37.16 24.14,37.12 24.06,37.1 22.06,37.1 21.98,37.12 21.91,37.16 21.87,37.23 21.85,37.3
VCC on Top Layer: 21.09,39.93 30.82,39.93 31.07,39.69 31.07,34.6 29.98,34.12 26.93,32.9 26.77,33.31 23.12,37.09 21.09,37.09
VCC on Top Layer: 21.73,3.24 21.74,3.32 21.79,3.39 21.85,3.43 21.93,3.45 24.83,3.45 24.9,3.43 24.97,3.39 25.01,3.32 25.03,3.24 25.03,-0.03 25.01,-0.11 24.97,-0.18 24.9,-0.22 24.83,-0.24 21.93,-0.24 21.85,-0.22 21.79,-0.18 21.74,-0.11 21.73,-0.03
VCC on Bottom Layer: 33.61,39.57 21.85,39.57 21.85,37.6 21.98,37.48 24.9,37.48 25.28,37.09 25.28,34.79 26.09,33.98 26.09,32.09 26.17,32.01 26.17,31.55 26.91,30.8 30.3,30.8 30.74,30.36 30.74,14.29 29.67,14.29 29.16,13.22 28.61,12.08 28.62,12.08 27.16,8.65 23.76,5.24 23.76,4.58 22.11,2.93 21.76,2.93 21.76,-0.12 25.16,-0.12 26.17,0.9 26.17,1.86 25.79,2.24 25.79,3.69 25.92,3.82 27.82,3.82 29.85,5.85 29.85,5.98 29.47,6.36 29.47,8.77 30.87,10.17 31.23,10.17 31.56,10.5 33.59,10.5 33.66,10.42 33.66,39.51
VCC on Bottom Layer: 16.53,33.65 15.82,33.65 15.26,34.76 14.74,35.89 17.06,36.96 18.24,34.24 18.71,33.42 18.85,33.21 17.31,32.39
VCC on Bottom Layer: 12.75,7.31 11.49,5.98 11.42,5.98 13.13,4.28 13.26,4.28 13.63,4.65 14.92,3.36 16.49,4.93 16.58,4.93 15.01,6.5 15.01,6.74 14.19,5.92 14.19,5.88
VCC on Inner1: 21.73,39.53 21.73,36.33 15.83,36.33 15.83,35.19 24.25,35.19 24.25,39.36 24.39,39.51 24.37,39.53
VCC on Inner1: 21.85,0.5 21.85,3.59 14.57,3.59 13.09,5.07 13.09,5.09 14.09,6.09 14.19,6.09 15.7,4.58 23.45,4.58 24.11,3.92 24.11,0.85 23.77,0.5
VCC on Inner2: 23.93,0.14 21.85,0.14 21.85,2.93 21.98,3.06 22.23,3.06 27.04,8.19 28.46,11.95 29.23,13.67 30.62,14.02 30.62,31.9 29.23,33.28 28.75,33.67 26.53,35.13 25.28,37.09 22.06,37.1 22.06,39.94 21.98,40.02 24.43,40.02 26.19,38.9 29.32,37.48 31.22,36.14 33.43,33.93 33.43,12.96 29.47,8.56 29.47,6.11 24.27,0.9 24.27,0.47
SH_A on Top Layer: 33.92,29.6 34.81,29.6 34.81,27.42 35.19,27.42 35.19,26.71 36.95,24.95 36.95,21.78 34.93,21.78 34.93,24.27 32.01,24.27 32.01,27.32 33.92,27.32
SH_B on Top Layer: 33.84,22.89 34.81,22.89 34.81,21.6 36.97,21.6 36.97,17.92 35.06,17.92 34.68,17.54 32.01,17.54 32.01,20.6 33.84,20.6
SH_C on Top Layer: 32.01,10.68 35.3,10.68 35.3,12.73 36.94,14.38 36.94,17.86 35.13,17.86 34.81,17.54 34.81,16.27 33.92,16.27 33.92,13.98 32.01,13.98
SL_A on Top Layer: 28.58,24.14 28.58,25.92 30.83,25.92 30.83,26.87 31.63,26.87 31.63,25.16 30.36,25.16 30.36,24.14
SL_B on Top Layer: 28.58,17.41 28.58,19.31 30.88,19.31 30.88,20.12 31.63,20.12 31.63,18.3 30.75,18.3 30.37,17.41
SL_C on Top Layer: 30.87,13.35 31.62,13.35 31.62,11.57 30.32,11.57 30.32,11.06 28.58,11.06 28.58,12.84 30.87,12.84
$1N4693 on Bottom Layer: 15.92,3.74 17.41,2.25 17.41,2.04 18.48,3.11 19.43,3.11 22.17,5.85 20.98,7.04 18.02,4.07 17.41,4.07 16.77,4.71 15.92,3.85
$1N4736 on Bottom Layer: 15,38.49 15.39,37.54 15.88,36.58 15.61,36.44 15.52,36.44 14.74,36.08 14.46,36.74 13.9,36.73 12.07,35.95 10.22,35.12 10.03,35.54 9.53,36.59 13.2,38.36 13.47,38.36 13.73,37.86 14.93,38.47

Small or netless copper shapes (teardrops, artwork), in the pictures only: 6 on Bottom Layer

## Text on the board
Bottom Silkscreen Layer: ▲ | |+3.3V| | MT6701 | PGND | VCC | |A3.3V| | |+12V| | |+5V|
Top Silkscreen Layer: PGND | VCC | CANL | CANH | TX | RX | 3.3V | GND | SWD | SCK | Driver> | FOC_FD6288Q / Version->V3.0 | Motor GIM43xx/35xx | MCU> | STM32G431CBU6 | FD6288Q | |RST| | KEY1 | A | B | C
